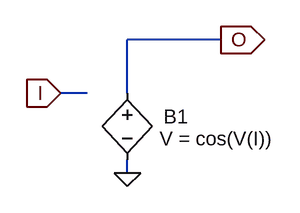
[diagram p0: schematic cos_module.asc]
cos_module.asc, the LTspice schematic file:
Version 4
SHEET 1 880 680
WIRE 224 128 112 128
WIRE 64 192 32 192
WIRE 112 192 112 128
WIRE 112 288 112 272
FLAG 32 192 I
IOPIN 32 192 In
FLAG 112 288 0
FLAG 224 128 O
IOPIN 224 128 Out
SYMBOL bv 112 176 R0
WINDOW 0 44 44 Left 0
WINDOW 3 39 71 Left 0
SYMATTR InstName B1
SYMATTR Value V = cos(V(I))

The netlist it stands for:
* cos_module.asc
B1 O 0 V = cos(V(I))
.backanno
.end